# Altium project Mach_ra_chan.PrjPcb
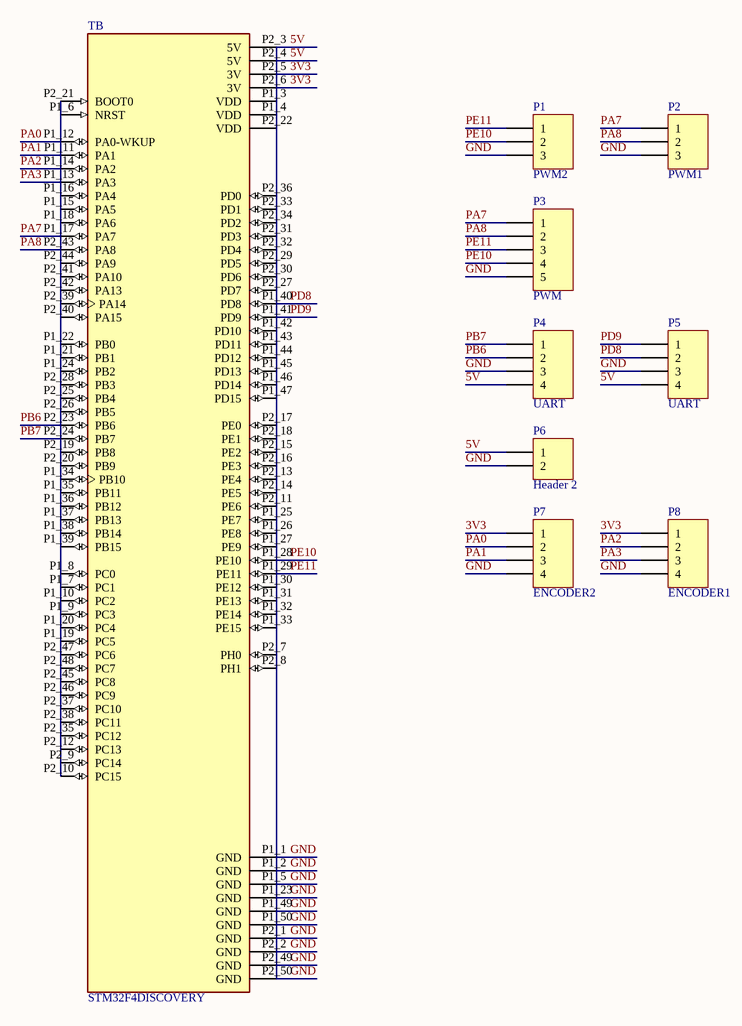
[diagram p0: Sheet.SchDoc]
1 sheet, 9 parts. Net scope: global (net labels, ports and power ports of the same name join across sheets).
Board file: PCB.PcbDoc

## Sheet Sheet.SchDoc
size A

### Parts
P1  PWM2  [HDR1X3]
P2  PWM1  [HDR1X3]
P3  PWM  [HDR1X5]
P4  UART  [HDR1X4]
P5  UART  [HDR1X4]
P6  Header 2  [HDR1X2]
P7  ENCODER2  [HDR1X4]
P8  ENCODER1  [HDR1X4]
TB  STM32F4DISCOVERY  [MODULE_STM32F4DISCOVERY]

### Nets
3V3: P1.1 P1.2 P1.3 P2.3 P3.3 P3.4 P3.5 P4.3 P4.4 P5.1 P5.2 P5.3 P5.4 P6.1 P6.2 P7.1 P7.4 P8.1 P8.4 TB.P1_1(GND) TB.P1_2(GND) TB.P1_3(VDD) TB.P1_4(VDD) TB.P1_5(GND) TB.P1_23(GND) TB.P1_25(PE7) TB.P1_26(PE8) TB.P1_27(PE9) TB.P1_28(PE10) TB.P1_29(PE11) TB.P1_30(PE12) TB.P1_31(PE13) TB.P1_32(PE14) TB.P1_33(PE15) TB.P1_40(PD8) TB.P1_41(PD9) TB.P1_42(PD10) TB.P1_43(PD11) TB.P1_44(PD12) TB.P1_45(PD13) TB.P1_46(PD14) TB.P1_47(PD15) TB.P1_49(GND) TB.P1_50(GND) TB.P2_1(GND) TB.P2_2(GND) TB.P2_3(5V) TB.P2_4(5V) TB.P2_5(3V) TB.P2_6(3V) TB.P2_7(PH0) TB.P2_8(PH1) TB.P2_11(PE6) TB.P2_13(PE4) TB.P2_14(PE5) TB.P2_15(PE2) TB.P2_16(PE3) TB.P2_17(PE0) TB.P2_18(PE1) TB.P2_22(VDD) TB.P2_27(PD7) TB.P2_29(PD5) TB.P2_30(PD6) TB.P2_31(PD3) TB.P2_32(PD4) TB.P2_33(PD1) TB.P2_34(PD2) TB.P2_36(PD0) TB.P2_49(GND) TB.P2_50(GND)  [also labelled 5V, GND, PD8, PD9, PE10, PE11]
PA0: P2.1 P2.2 P3.1 P3.2 P4.1 P4.2 P7.2 P7.3 P8.2 P8.3 TB.P1_6(NRST) TB.P1_7(PC1) TB.P1_8(PC0) TB.P1_9(PC3) TB.P1_10(PC2) TB.P1_11(PA1) TB.P1_12(PA0-WKUP) TB.P1_13(PA3) TB.P1_14(PA2) TB.P1_15(PA5) TB.P1_16(PA4) TB.P1_17(PA7) TB.P1_18(PA6) TB.P1_19(PC5) TB.P1_20(PC4) TB.P1_21(PB1) TB.P1_22(PB0) TB.P1_24(PB2) TB.P1_34(PB10) TB.P1_35(PB11) TB.P1_36(PB12) TB.P1_37(PB13) TB.P1_38(PB14) TB.P1_39(PB15) TB.P2_9(PC14) TB.P2_10(PC15) TB.P2_12(PC13) TB.P2_19(PB8) TB.P2_20(PB9) TB.P2_21(BOOT0) TB.P2_23(PB6) TB.P2_24(PB7) TB.P2_25(PB4) TB.P2_26(PB5) TB.P2_28(PB3) TB.P2_35(PC12) TB.P2_37(PC10) TB.P2_38(PC11) TB.P2_39(PA14) TB.P2_40(PA15) TB.P2_41(PA10) TB.P2_42(PA13) TB.P2_43(PA8) TB.P2_44(PA9) TB.P2_45(PC8) TB.P2_46(PC9) TB.P2_47(PC6) TB.P2_48(PC7)  [also labelled PA1, PA2, PA3, PA7, PA8, PB6, PB7]

### Library data of the parts
P1 P2 = Header 3: Header, 3-Pin; LatestRevisionDate: 17-Jul-2002; LatestRevisionNote: Re-released for DXP Platform.; Publisher: Altium Limited
P3 = Header 5: Header, 5-Pin; LatestRevisionDate: 17-Jul-2002; LatestRevisionNote: Re-released for DXP Platform.; Publisher: Altium Limited
P4 P5 P7 P8 = Header 4: Header, 4-Pin; LatestRevisionDate: 17-Jul-2002; LatestRevisionNote: Re-released for DXP Platform.; Publisher: Altium Limited
P6 = Header 2: Header, 2-Pin; LatestRevisionDate: 17-Jul-2002; LatestRevisionNote: Re-released for DXP Platform.; Publisher: Altium Limited
TB = STM32F4DISCOVERY: STM32F407VGT6 Discovery STM32F4 ARMÂ® CortexÂ®-M4 MCU 32-Bit Embedded Evaluation Board; MF: STMicroelectronics; MP: STM32F4DISCOVERY; Package: None; Price: None; Availability: Unavailable; Value: *; SnapEDA_Link: https://www.snapeda.com/parts/STM32F4DISCOVERY/STMicroelectronics/view-part/46335/?ref=snap